# Altium schematic sheet bmsMaster_can.SchDoc
size A; SheetNumber: 6; SheetTotal: 6
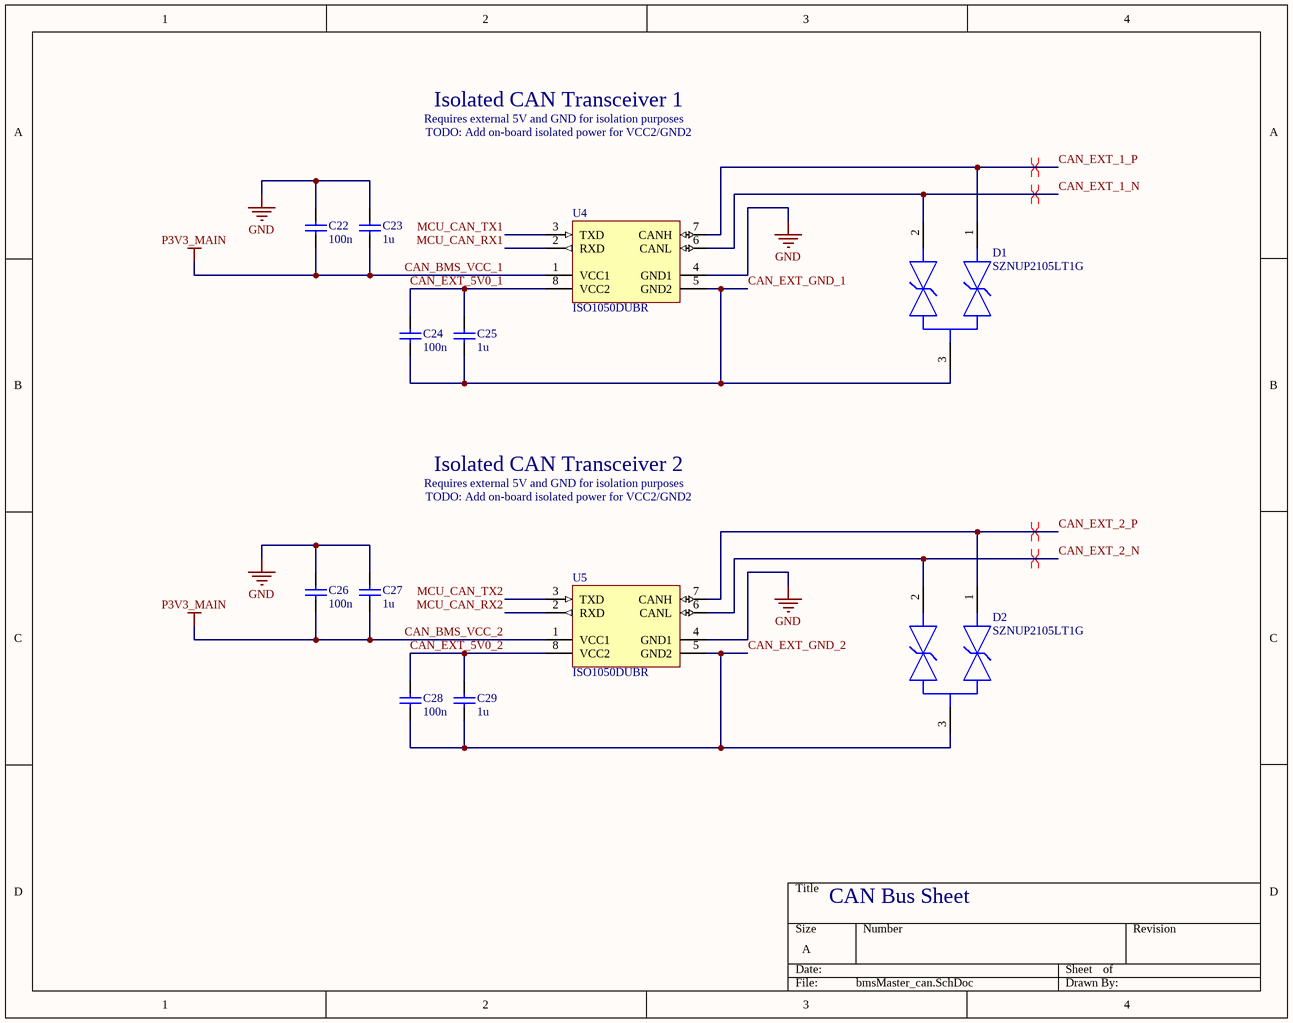
[diagram p0: bmsMaster_can.SchDoc]

## Parts
C22  value 100n  (hidden comment: Capacitor)
C23  value 1u  (hidden comment: Capacitor)
C24  value 100n  (hidden comment: Capacitor)
C25  value 1u  (hidden comment: Capacitor)
C26  value 100n  (hidden comment: Capacitor)
C27  value 1u  (hidden comment: Capacitor)
C28  value 100n  (hidden comment: Capacitor)
C29  value 1u  (hidden comment: Capacitor)
D1  SZNUP2105LT1G  [FP-318-08-MFG]
D2  SZNUP2105LT1G  [FP-318-08-MFG]
U4  ISO1050DUBR  [DUB0008A_L]
U5  ISO1050DUBR  [DUB0008A_L]

## Nets
CAN_BMS_VCC_1: C22.1 C23.1 C26.1 C27.1 U4.1(VCC1) U5.1(VCC1)  [also labelled CAN_BMS_VCC_2, P3V3_MAIN]
GND: C22.2 C23.2 C26.2 C27.2 U4.4(GND1) U5.4(GND1)
CAN_EXT_1_N: D1.2 U4.6(CANL)
CAN_EXT_1_P: D1.1 U4.7(CANH)
CAN_EXT_2_N: D2.2 U5.6(CANL)
CAN_EXT_2_P: D2.1 U5.7(CANH)
CAN_EXT_5V0_1: C24.2 C25.2 U4.8(VCC2)
CAN_EXT_5V0_2: C28.2 C29.2 U5.8(VCC2)
CAN_EXT_GND_1: C24.1 C25.1 D1.3 U4.5(GND2)
CAN_EXT_GND_2: C28.1 C29.1 D2.3 U5.5(GND2)
MCU_CAN_RX1: U4.2(RXD)
MCU_CAN_RX2: U5.2(RXD)
MCU_CAN_TX1: U4.3(TXD)
MCU_CAN_TX2: U5.3(TXD)

## Layout directives
differential pair: CAN_EXT_1_N, CAN_EXT_1_P, CAN_EXT_2_N, CAN_EXT_2_P

## Notes on the sheet
- Requires external 5V and GND for isolation purposes
- Isolated CAN Transceiver 1
- TODO: Add on-board isolated power for VCC2/GND2
- Isolated CAN Transceiver 2
- CAN Bus Sheet

## Library data of the parts
C22-C29 = Capacitor: SimulationGenericComponent: True
D1 D2 = CMP-1063-00167-2: TVS DIODE 24V 44V SOT23-3; Manufacturer: ON Semiconductor; Capacitance: 30pF; Max Junction Temp: +150°C; Breakdown Voltage: 26.2V; Number Of Channels: 2; Automotive Grade: Grade 0; Standoff Height: 0.01mm; Peak Pulse Current: 8A; Value: 30pF; Direction: Bidirectional; Peak Pulse Power: 350W; Octopart: https://octopart.com/sznup2105lt1g-on+semiconductor-22134626; Reverse Standoff Voltage: 24V; Digikey Description: TVS DIODE 24V 44V SOT23-3; RoHS: TRUE; Manufacturer Part Number: SZNUP2105LT1G; Height: 1.11mm; Automotive: Yes; ComponentLink2URL: https://www.onsemi.com/pub/Collateral/NUP2105L-D.PDF; Device Class L3: unset; Package: 318-08; Lead Free: Yes; Device Class L2: TVS Diodes; Footprint Url: https://www.onsemi.com/pub/Collateral/318-08.PDF; Temperature Range Low: -55°C; Device Class L1: Circuit Protection; Temperature: -55°C to +150°C; Temperature Range High: +150°C; Category: Diode; Clamping Voltage: 44V; ComponentLink2Description: Datasheet
U4 U5 = CMP-0315-00093-2: Isolated CAN Transceiver, -55 to 105 degC, 8-pin SOP (DUB), Green (RoHS & no Sb/Br); Manufacturer: Texas Instruments; Rating: Catalog; Isolated: Yes; Drivers Per Package: 1; PackageReference: DUB0008A; PartNumber: ISO1050DUBR; ComponentLink2Description: Package Specification; ComponentLink1Description: Datasheet; Mounting Technology: Surface Mount; ComponentLink1URL: http://www.ti.com/general/docs/lit/getliterature.tsp?genericPartNumber=ISO1050&fileType=pdf; ComponentLink2URL: http://www.ti.com/litv/pdf/mpds247b; Eco-Plan: Green (RoHS & no Sb/Br); PackageDescription: 8-Pin Small Outline Package 2.54 mm Pitch; PackageVersion: revC, May-2006; SubFamily: CAN; DatasheetVersion: SLLS983E